# Altium schematic sheet pico_vga_sd_aud.SchDoc
size 419 x 297 mm
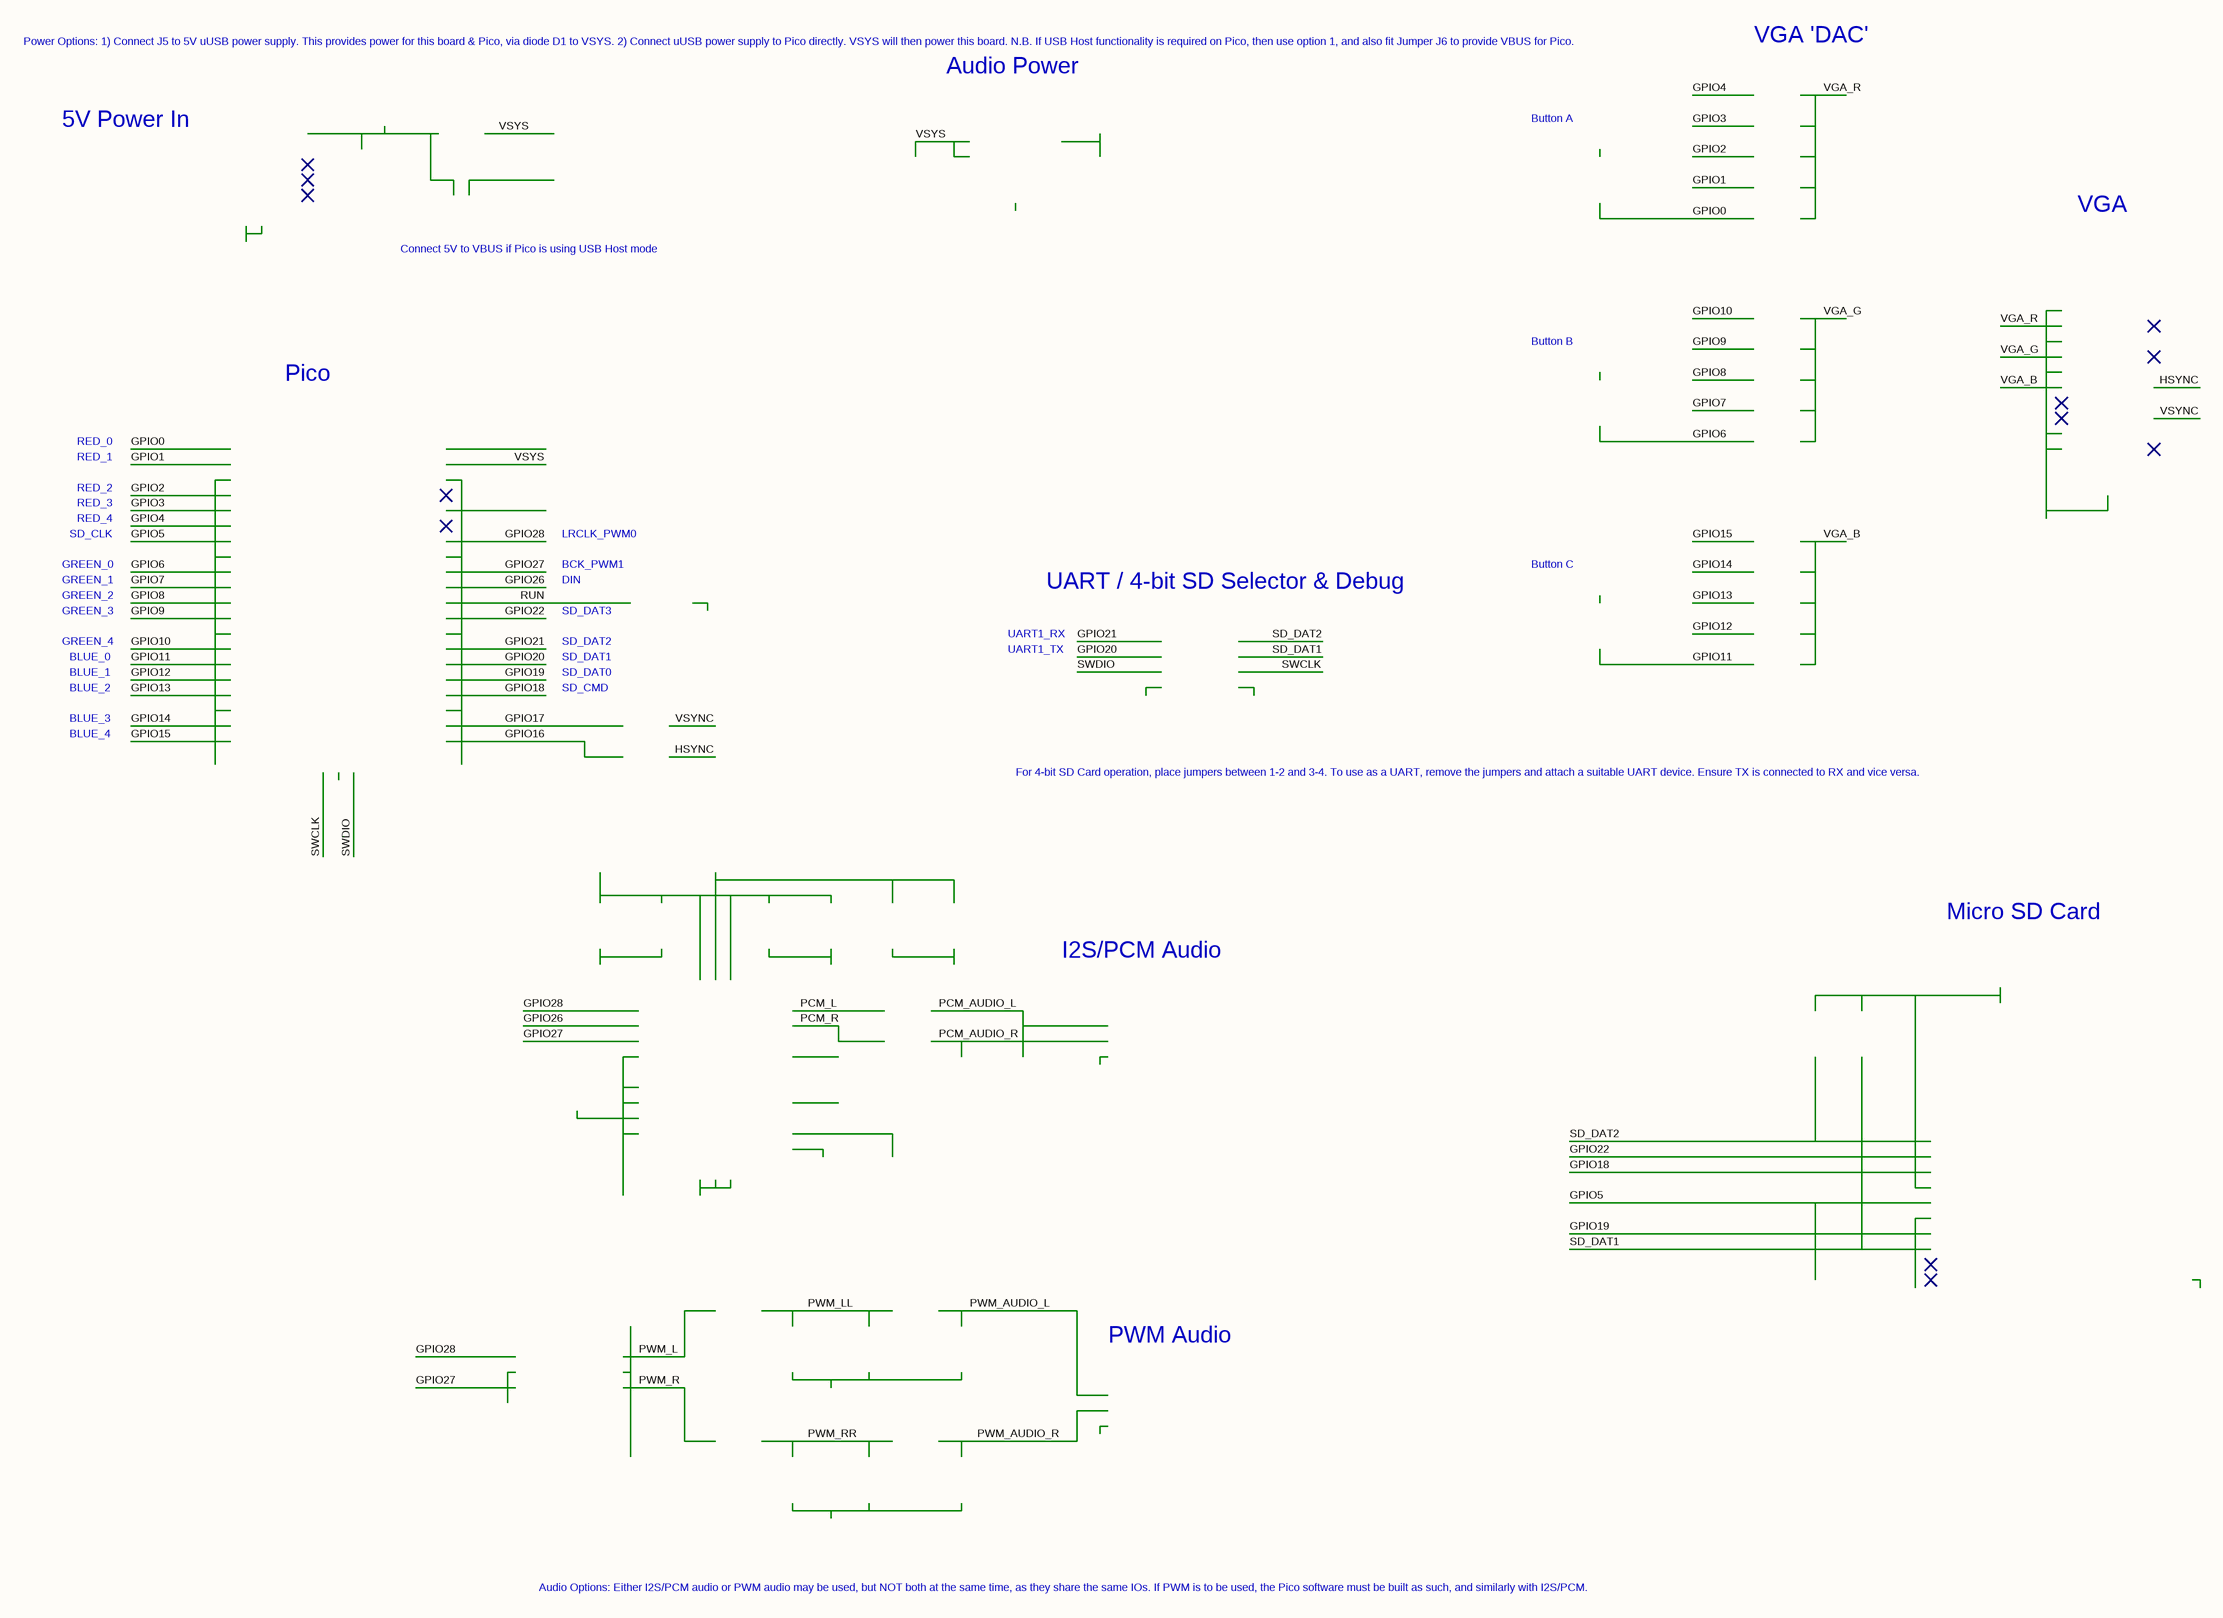
[diagram p0: pico_vga_sd_aud.SchDoc]

## Notes on the sheet
- Power Options:
  1) Connect J5 to 5V uUSB power supply. This provides power for this board & Pico, via diode D1 to VSYS.
  2) Connect uUSB power supply to Pico directly. VSYS will then power this board.
  N.B. If USB Host functionality is required on Pico, then use option 1, and also fit Jumper J6 to provide VBUS for Pico.
- VGA 'DAC'
- Audio Power
- 5V Power In
- Button A
- Connect 5V to VBUS if Pico is using USB Host mode
- VGA
- Button B
- Pico
- RED_0
- RED_1
- RED_2
- RED_3
- GREEN_0
- SD_CLK
- RED_4
- BCK_PWM1
- LRCLK_PWM0
- Button C
- GREEN_1
- GREEN_2
- GREEN_3
- GREEN_4
- BLUE_0
- SD_DAT1
- SD_DAT2
- SD_DAT3
- DIN
- UART1_TX
- UART1_RX
- UART / 4-bit SD Selector
  & Debug
- BLUE_1
- BLUE_2
- BLUE_3
- SD_CMD
- SD_DAT0
- BLUE_4
- For 4-bit SD Card operation, place jumpers between 1-2 and 3-4.
  To use as a UART, remove the jumpers and attach a suitable UART device.
  Ensure TX is connected to RX and vice versa.
- I2S/PCM Audio
- Micro SD Card
- PWM Audio
- Audio Options:
  Either I2S/PCM audio or PWM audio may be used, but NOT both at the same time, as they share the same IOs.
  If PWM is to be used, the Pico software must be built as such, and similarly with I2S/PCM.
- 1
- 2
- 3
- 4
- 5
- 6
- 7
- 8
- A
- B
- C
- D
- E
- (c) Raspberry Pi 2020
- Title: RPI-PVSA    VGA, SD Card & Audio Demo Board for Pico
- File: pico_vga_sd_aud.sch
- Sheet: /
- Raspberry Pi
- F
- KiCad E.D.A.  kicad (5.1.4)-1
- Size: A4
- Date: 2020-09-04
- Rev: REV2
- Id: 1/1